# Altium schematic sheet pwm_fan_controller.SchDoc
size A4; SheetNumber: 10; SheetTotal: 12
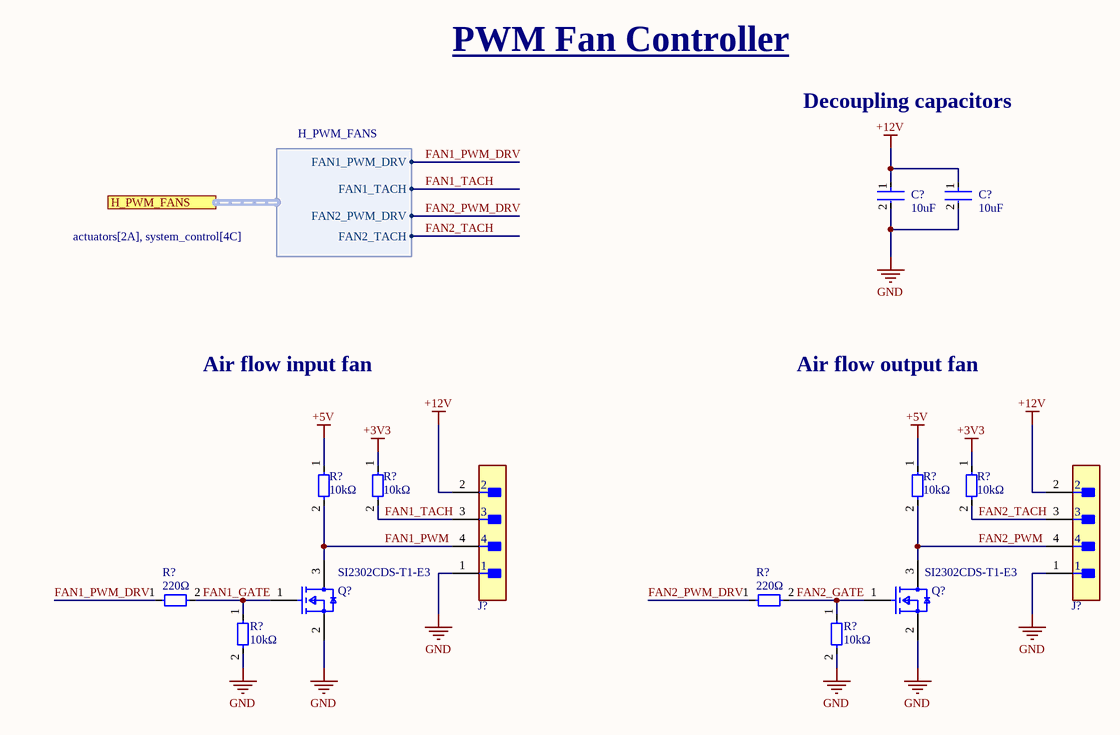
[diagram p0: pwm_fan_controller.SchDoc]

## Parts
(Parts that share a designator on the sheet are numbered #1, #2 ... from top to bottom, then left to right.)
C?#1  Capacitance: 10uF  [CAP_0805]  (hidden comment: Simbolo de capacitor genérico)
C?#2  Capacitance: 10uF  [CAP_0805]  (hidden comment: Simbolo de capacitor genérico)
J?#1  22-29-2041  [CONN_MOLEX_KK_4POS_2,54]  (value not drawn)
J?#2  22-29-2041  [CONN_MOLEX_KK_4POS_2,54]  (value not drawn)
Q?#1  SI2302CDS-T1-E3  [FP-S-03946-MFG]
Q?#2  SI2302CDS-T1-E3  [FP-S-03946-MFG]
R?#1  value 10kΩ  [RES_0805]  (hidden comment: Simbolo de resistencia genérica)
R?#2  value 10kΩ  [RES_0805]  (hidden comment: Simbolo de resistencia genérica)
R?#3  value 10kΩ  [RES_0805]  (hidden comment: Simbolo de resistencia genérica)
R?#4  value 10kΩ  [RES_0805]  (hidden comment: Simbolo de resistencia genérica)
R?#5  value 220Ω  [RES_0805]  (hidden comment: Simbolo de resistencia genérica)
R?#6  value 220Ω  [RES_0805]  (hidden comment: Simbolo de resistencia genérica)
R?#7  value 10kΩ  [RES_0805]  (hidden comment: Simbolo de resistencia genérica)
R?#8  value 10kΩ  [RES_0805]  (hidden comment: Simbolo de resistencia genérica)

## Ports
H_PWM_FANS (harness H_PWM_FANS, see actuators[2A], system_control[4C])

## Harnesses
H_PWM_FANS: FAN1_PWM_DRV, FAN1_TACH, FAN2_PWM_DRV, FAN2_TACH

## Nets
+3V3: R?#2.1 R?#4.1
+5V: R?#1.1 R?#3.1
+12V: C?#1.1 C?#2.1 J?#1.2 J?#2.2
GND: C?#1.2 C?#2.2 J?#1.1 J?#2.1 Q?#1.2(S) Q?#2.2(S) R?#7.2 R?#8.2
FAN1_GATE: Q?#1.1(G) R?#5.2 R?#7.1
FAN1_PWM: J?#1.4 Q?#1.3(D) R?#1.2
FAN1_PWM_DRV: R?#5.1 ; port H_PWM_FANS.FAN1_PWM_DRV
FAN1_TACH: J?#1.3 R?#2.2 ; port H_PWM_FANS.FAN1_TACH
FAN2_GATE: Q?#2.1(G) R?#6.2 R?#8.1
FAN2_PWM: J?#2.4 Q?#2.3(D) R?#3.2
FAN2_PWM_DRV: R?#6.1 ; port H_PWM_FANS.FAN2_PWM_DRV
FAN2_TACH: J?#2.3 R?#4.2 ; port H_PWM_FANS.FAN2_TACH

## Notes on the sheet
- PWM Fan Controller
- Decoupling capacitors
- Air flow input fan
- Air flow output fan

## Library data of the parts
C?#1 C?#2 = Generic C: Dielectric: X5R; Voltage Rating: 10V; Tolerance: 10%; Case Code (Imperial): 0805; Mount: Surface Mount; Depth: 1.25mm; Length: 2mm; Lead Free: Lead Free; Packaging: Tape and Reel; Width: 0.049inch; Package Quantity: 1; Height: 1.25mm; Case/Package: 0805; Thickness: 0.053inch; Max Operating Temperature: 85°C; Case Code (Metric): 2012; Contact Plating: Tin; Min Operating Temperature: -55°C; Radiation Hardening: No; Voltage Rating (DC): 10V
J?#1 J?#2 = CONN_MOLEX_KK_4POS_2,54MM_ALT: CONN HEADER VERT 4POS 2.54MM MOLEX KK; Insulation Resistance: 50GR; Voltage Rating: 250V; Glow Wire Compliant: Non-compliant; Max Current Rating: 4A; Number of Circuits: 4; Contact Resistance: 10mR; Gender: Male; Number of Lines: 1; Length: 10.16mm; Radiation Hardening: No; Pitch: 2.54mm; Contact Material: Brass; Height: 11.7mm; Max Operating Temperature: 75°C; Flammability Rating: UL94 V-0; Mount: Through Hole; Voltage Rating (DC): 250V; Halogen Free: Low Halogen; Housing Color: White; Package Quantity: 1500; Series: KK® 6410; Number of Rows: 1; Housing Material: Nylon; Depth: 5.8mm; RoHS Compliant: Yes; Orientation: Straight; Contact Gender: Male; Color: Natural; Current Rating: 4A; Contact Mating Length: 0.295inch; Number of Poles: 4; Packaging: Bulk; Contact Type: Male Pin; Termination: Solder; Number of Positions: 4; Number of Contacts: 4; Lead Free: Lead Free; Min Operating Temperature: 0°C; Fastening Type: Friction; Contact Plating: Gold
Q?#1 Q?#2 = CMP-02550-000184-1: MOSFET N-CH 20V 2.6A SOT-23; Manufacturer: Vishay; Gate To Source Voltage: 8V; Max Forward Diode Voltage: 1.2V; Pulse Drain Current: 10A; Typ Forward Diode Voltage: 0.7V; Number Of N Channels: 1; Reverse Recovery Charge: 2nC; Power Dissipation: 0.71W; Reverse Recovery Time: 8.5ns; Threshold Vgs Min: 0.4V; Drain To Source Resistance: 0.045Ω; Gate Charge At Vgs: 3.5nC @ 4.5V; Turn Off Delay Time: 30ns; Rthja Max: 140°C/W; Max Junction Temp: +150°C; Transconductance: 13S; Depletion Mode: False; Standoff Height: 0.01mm; Turn On Delay Time: 8ns; Threshold Vgs Max: 0.85V; Manufacturer Part Number: SI2302CDS-T1-E3; Mouser Description: MOSFET 20V 2.9A 0.86W 57mohm @ 4.5V; Digikey Description: MOSFET N-CH 20V 2.6A SOT-23; Drain To Source Voltage: 20V; Lead Free: Yes; Temperature Range High: +150°C; Automotive: No; ComponentLink2URL: http://www.vishay.com/docs/68645/si2302cds.pdf; Height: 1.12mm; ComponentLink2Description: Datasheet; Octopart: https://octopart.com/si2302cds-t1-e3-vishay-44452855; Continuous Drain Current: 2.6A; Drain To Source Breakdown Voltage: 20V; Number Of Channels: 1; Device Class L3: MOSFETs; Device Class L1: Discrete Semiconductors; Temperature Range Low: -55°C; Package: S-03946; RoHS: TRUE; Device Class L2: Transistors; Temperature: -55°C to +150°C; Category: Trans
R?#1-R?#8 = Generic R